# Altium schematic sheet CATS-Vega-Radio.SchDoc: CATS Vega
size A4; Author: Luca Jost; Revision: V1.0; SheetNumber: 14; SheetTotal: 16; Subtitle: Radio
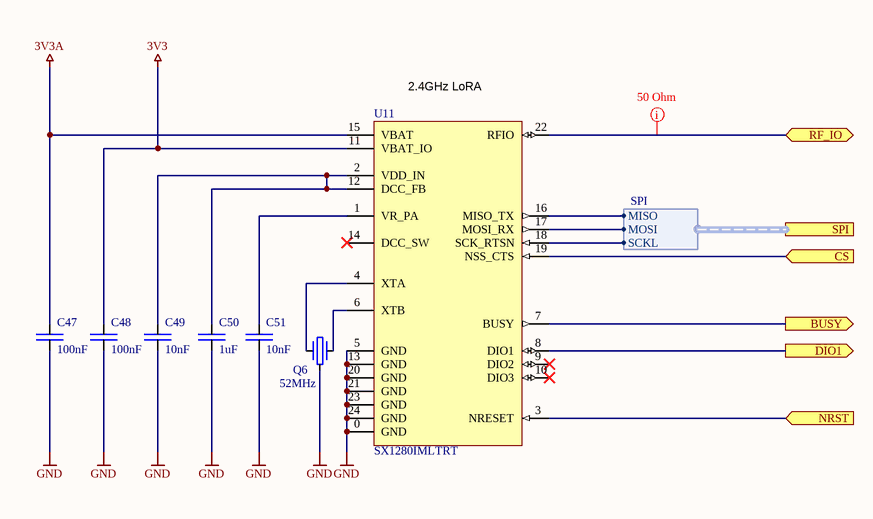
[diagram p0: CATS-Vega-Radio.SchDoc]

## Parts
C47  100nF  [SMD Keramikkondensator 0603]
C48  100nF  [SMD Keramikkondensator 0603]
C49  10nF  [SMD Keramikkondensator 0603]
C50  1uF  [SMD Keramikkondensator 0603]
C51  10nF  [SMD Keramikkondensator 0603]
Q6  52MHz  [SMD Crystal 2520]
U11  SX1280IMLTRT  [SMD IC QFN-24]

## Ports
BUSY (out), CS (in), DIO1 (out), NRST (in), RF_IO (bidir), SPI (harness SPI)

## Harnesses
SPI: SCKL, MOSI, MISO

## Nets
3V3: C48.2 U11.11(VBAT_IO)
3V3A: C47.2 U11.15(VBAT)
GND: C47.1 C48.1 C49.1 C50.1 C51.1 Q6.3 U11.0(GND) U11.5(GND) U11.13(GND) U11.20(GND) U11.21(GND) U11.23(GND) U11.24(GND)
BUSY: U11.7(BUSY) ; port BUSY
CS: U11.19(NSS_CTS) ; port CS
DIO1: U11.8(DIO1) ; port DIO1
NRST: U11.3(NRESET) ; port NRST
RF_IO: U11.22(RFIO) ; port RF_IO
NetC49_2: C49.2 C50.2 U11.2(VDD_IN) U11.12(DCC_FB)
NetC51_2: C51.2 U11.1(VR_PA)
NetQ6_1: Q6.1 U11.4(XTA)
NetQ6_2: Q6.2 U11.6(XTB)
NetU11_16: U11.16(MISO_TX) ; port SPI.MISO
NetU11_17: U11.17(MOSI_RX) ; port SPI.MOSI
NetU11_18: U11.18(SCK_RTSN) ; port SPI.SCKL

Not connected (* = marked no-connect by the designer): U11 9(DIO2)* 10(DIO3)* 14(DCC_SW)*

## Layout directives
rule Impedance Constraint [Min = 50.00    Max = 50.00    ]; net class RF-Line 50: RF_IO

## Notes on the sheet
- (near U11) 2.4GHz LoRA
- Title
- Author:
- Subtitle
- Date:
- Rev:
- File:
- Sheet
- of

## Library data of the parts
C47 C48 = E6 - 100nF: SMD Ceramic Capacitor E6; Unit Price: 0.0024; JLC: C1591
C49 C51 = E6 - 10nF: SMD Ceramic Capacitor E6; Unit Price: 0.0015; JLC: C1589
C50 = E6 - 1uF: SMD Ceramic Capacitor E6; Unit Price: 0.0047; JLC: C15849
Q6 = Crystal 52MHz - 2520: 52Mhz Ceramic 2.5 x 2.0mm SMD 10pF 60Ω ±10ppm; JLC: C963550; ComponentLink1Description: Datasheet; ComponentLink1URL: https://datasheet.lcsc.com/lcsc/2012211835_WTL-WTL2M75523TW_C963550.pdf; Unit Price: 0.2466; Digikey: 50-ECS-520-8-36B-CTN-TR-ND; Mouser: 520-520-8-36B-CTN-TR
U11 = SX1280IMLTRT: Long Range, Low Power, 2.4 GHz / Transceiver with Ranging Capability; ComponentLink1Description: Datasheet; ComponentLink1URL: https://media.digikey.com/pdf/Data%20Sheets/Semtech%20PDFs/SX1280-81_Rev3.2_Mar2020.pdf; Digikey: SX1280IMLTRTCT-ND; JLC: C125969; Unit Price: 5.50000